# Altium schematic sheet chess_module_LEDs.SchDoc
size A; SheetNumber: 1; SheetTotal: 3
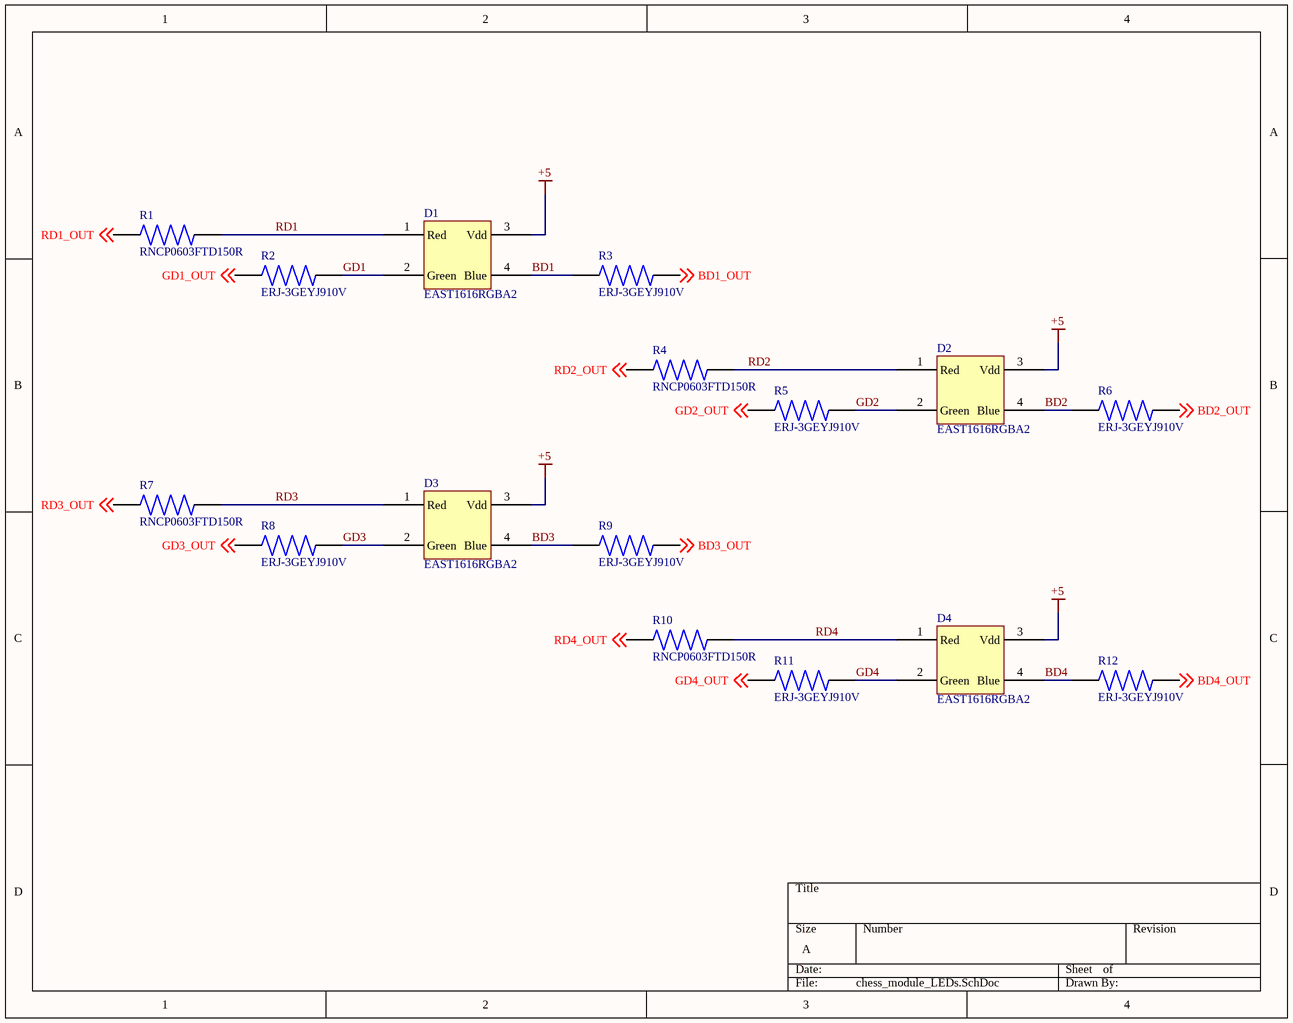
[diagram p0: chess_module_LEDs.SchDoc]

## Parts
D1  EAST1616RGBA2  [EAST1616RGBA2]
D2  EAST1616RGBA2  [EAST1616RGBA2]
D3  EAST1616RGBA2  [EAST1616RGBA2]
D4  EAST1616RGBA2  [EAST1616RGBA2]
R1  RNCP0603FTD150R  [RESC1508X50N]
R2  ERJ-3GEYJ910V  [RESC1608X55N]
R3  ERJ-3GEYJ910V  [RESC1608X55N]
R4  RNCP0603FTD150R  [RESC1508X50N]
R5  ERJ-3GEYJ910V  [RESC1608X55N]
R6  ERJ-3GEYJ910V  [RESC1608X55N]
R7  RNCP0603FTD150R  [RESC1508X50N]
R8  ERJ-3GEYJ910V  [RESC1608X55N]
R9  ERJ-3GEYJ910V  [RESC1608X55N]
R10  RNCP0603FTD150R  [RESC1508X50N]
R11  ERJ-3GEYJ910V  [RESC1608X55N]
R12  ERJ-3GEYJ910V  [RESC1608X55N]

## Nets
+5: D1.3(Vdd) D2.3(Vdd) D3.3(Vdd) D4.3(Vdd)
BD1: D1.4(Blue) R3.2
BD1_OUT: R3.1 ; off-sheet BD1_OUT
BD2: D2.4(Blue) R6.2
BD2_OUT: R6.1 ; off-sheet BD2_OUT
BD3: D3.4(Blue) R9.2
BD3_OUT: R9.1 ; off-sheet BD3_OUT
BD4: D4.4(Blue) R12.1
BD4_OUT: R12.2 ; off-sheet BD4_OUT
GD1: D1.2(Green) R2.2
GD1_OUT: R2.1 ; off-sheet GD1_OUT
GD2: D2.2(Green) R5.2
GD2_OUT: R5.1 ; off-sheet GD2_OUT
GD3: D3.2(Green) R8.1
GD3_OUT: R8.2 ; off-sheet GD3_OUT
GD4: D4.2(Green) R11.2
GD4_OUT: R11.1 ; off-sheet GD4_OUT
RD1: D1.1(Red) R1.2
RD1_OUT: R1.1 ; off-sheet RD1_OUT
RD2: D2.1(Red) R4.2
RD2_OUT: R4.1 ; off-sheet RD2_OUT
RD3: D3.1(Red) R7.1
RD3_OUT: R7.2 ; off-sheet RD3_OUT
RD4: D4.1(Red) R10.2
RD4_OUT: R10.1 ; off-sheet RD4_OUT

## Library data of the parts
R2 R3 R5 R6 R8 R9 R11 R12 = ERJ-3GEYJ910V: Res Thick Film 0603 91 Ohm 5% 1/10W Ã‚Â±200ppm/Ã‚Â°C Molded SMD SMD Punched Carrier T/R; Package: None; Price: None; Value: *; MP: ERJ-3GEYJ910V; Availability: Unavailable
R1 R4 R7 R10 = RNCP0603FTD150R: Package: None; Price: None; Value: *; MP: RNCP0603FTD150R; Availability: Unavailable